# Altium schematic sheet Hard.SchDoc
size A
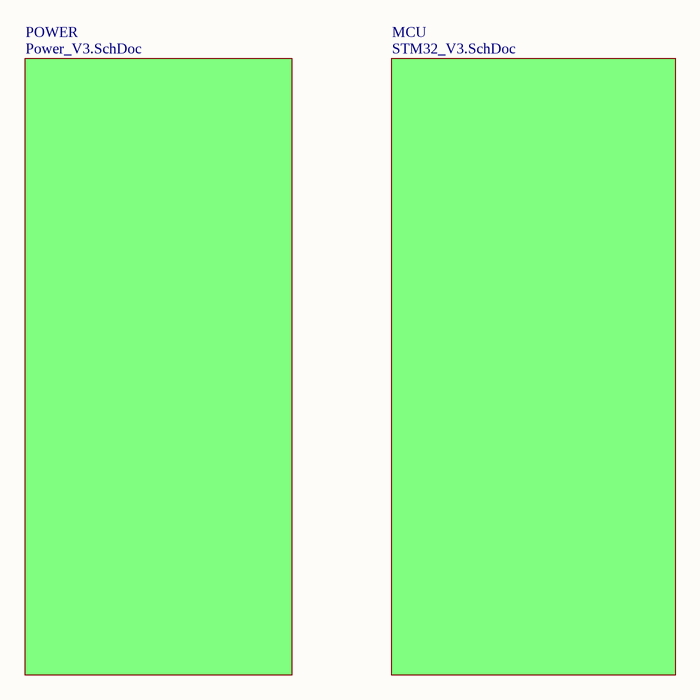
[diagram p0: Hard.SchDoc]

## Sub-sheets
MCU = STM32_V3.SchDoc: no entries
POWER = Power_V3.SchDoc: no entries